# Altium schematic sheet CAMERA_INTERFACE.SchDoc
size B; SheetNumber: 6; SheetTotal: 10
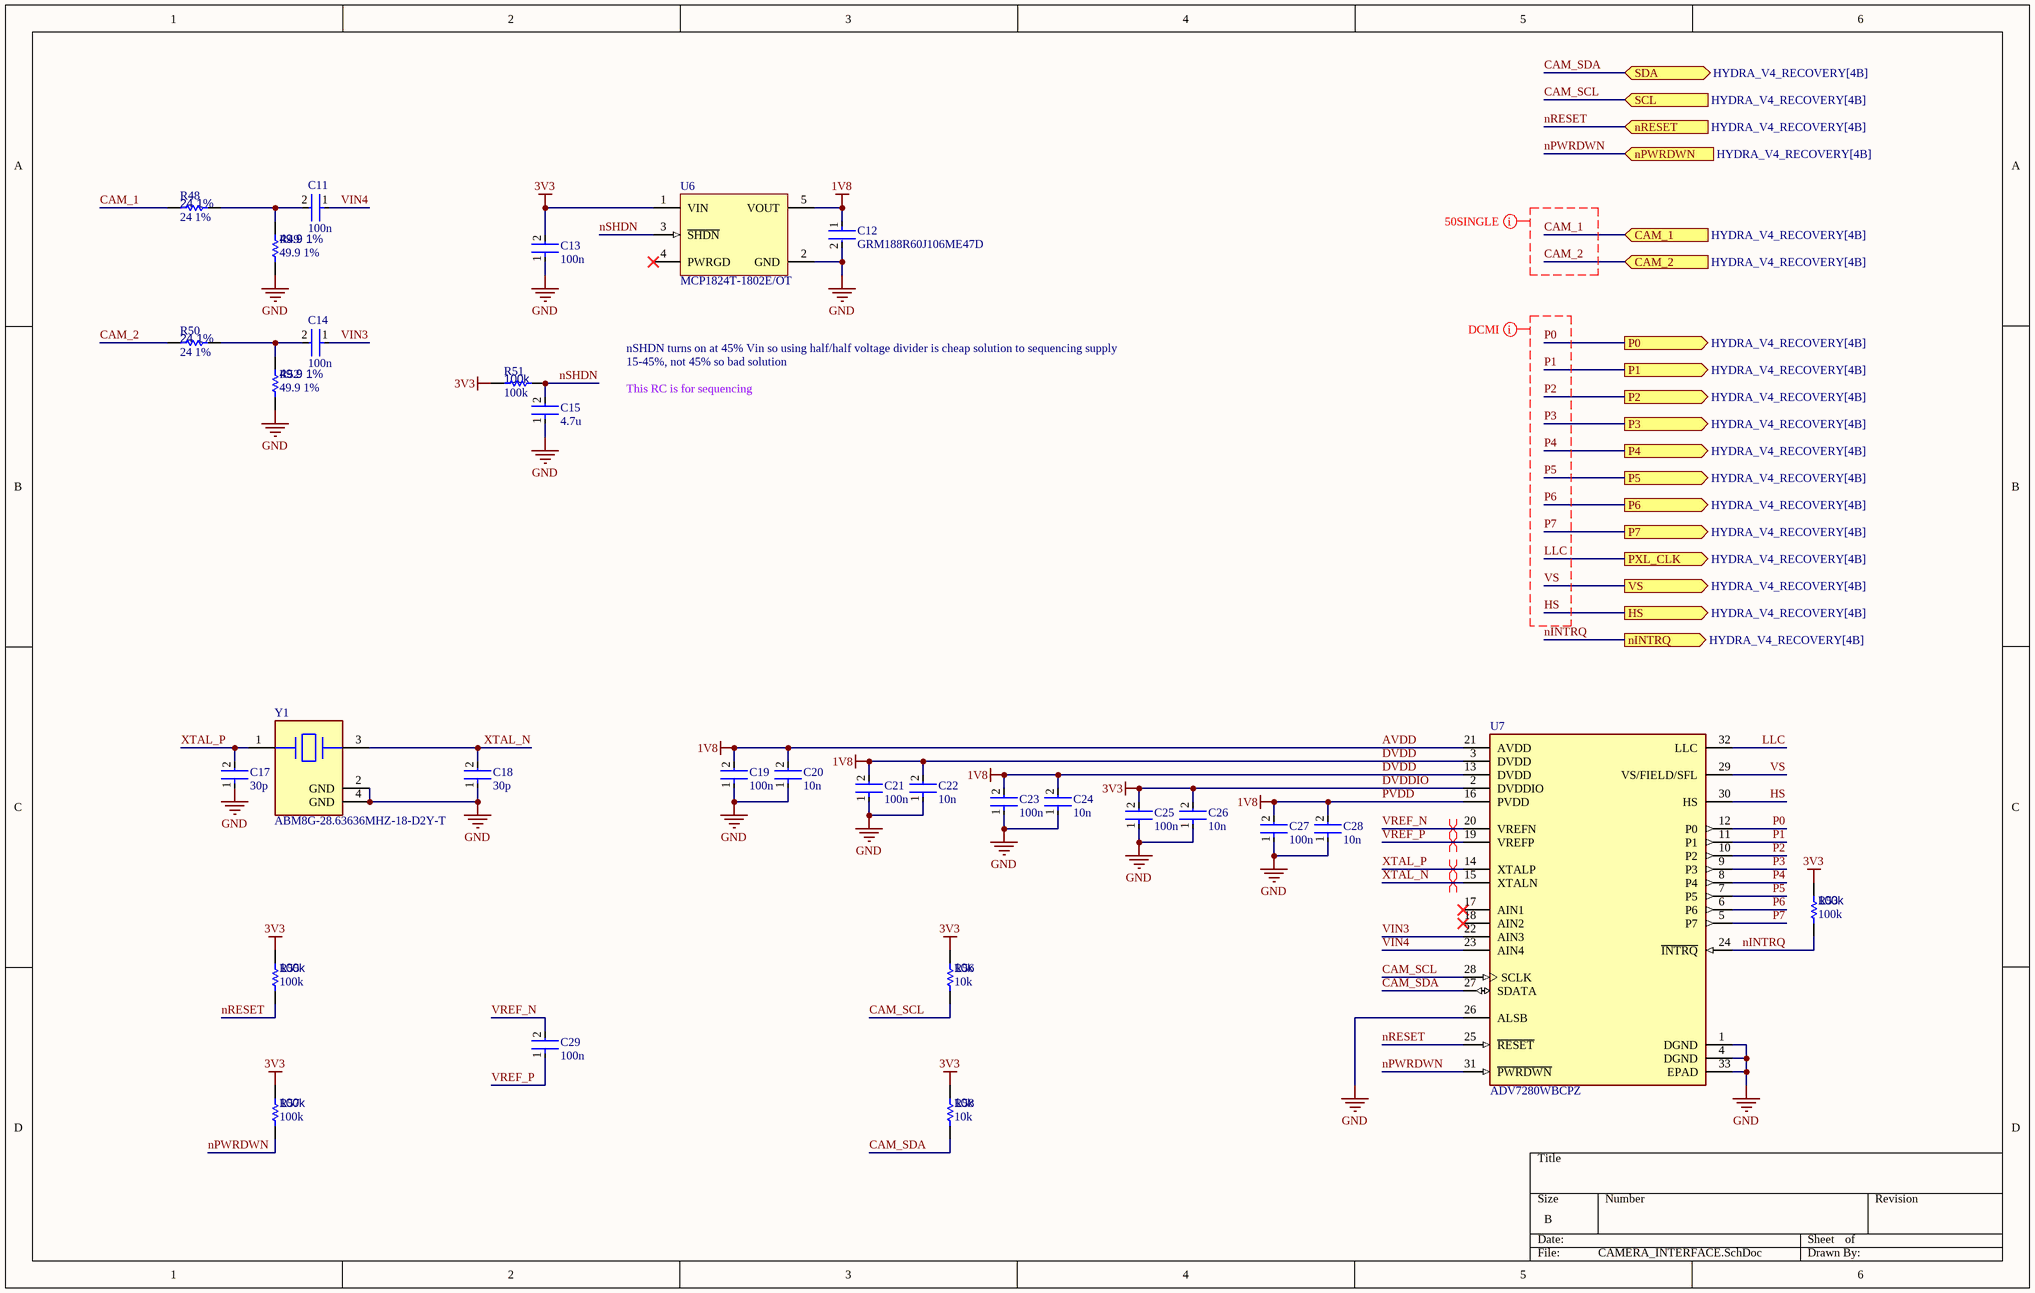
[diagram p0: CAMERA_INTERFACE.SchDoc]

## Parts
C11  100n  [FP-0402-L_1_0_0_05-W_0_5-IPC_A]
C12  GRM188R60J106ME47D  [FP-GRM188-0_1-e0_2_0_55-IPC_A]
C13  100n  [FP-0402-L_1_0_0_05-W_0_5-IPC_A]
C14  100n  [FP-0402-L_1_0_0_05-W_0_5-IPC_A]
C15  4.7u  [FP-0402-L_1_0_0_05-W_0_5-IPC_A]
C17  30p  [FP-0402-L_1_0_0_05-W_0_5-IPC_A]
C18  30p  [FP-0402-L_1_0_0_05-W_0_5-IPC_A]
C19  100n  [FP-0402-L_1_0_0_05-W_0_5-IPC_A]
C20  10n  [FP-0402-L_1_0_0_05-W_0_5-IPC_A]
C21  100n  [FP-0402-L_1_0_0_05-W_0_5-IPC_A]
C22  10n  [FP-0402-L_1_0_0_05-W_0_5-IPC_A]
C23  100n  [FP-0402-L_1_0_0_05-W_0_5-IPC_A]
C24  10n  [FP-0402-L_1_0_0_05-W_0_5-IPC_A]
C25  100n  [FP-0402-L_1_0_0_05-W_0_5-IPC_A]
C26  10n  [FP-0402-L_1_0_0_05-W_0_5-IPC_A]
C27  100n  [FP-0402-L_1_0_0_05-W_0_5-IPC_A]
C28  10n  [FP-0402-L_1_0_0_05-W_0_5-IPC_A]
C29  100n  [FP-0402-L_1_0_0_05-W_0_5-IPC_A]
R48  24 1%  [R0603B]
R49  49.9 1%  [R0603B]
R50  24 1%  [R0603B]
R51  100k  [R0603B]
R52  49.9 1%  [R0603B]
R53  100k  [R0603B]
R55  100k  [R0603B]
R56  10k  [R0603B]
R57  100k  [R0603B]
R58  10k  [R0603B]
U6  MCP1824T-1802E/OT  [SOT-23-OT5_M]
U7  ADV7280WBCPZ  [FP-CP-32-12-MFG]
Y1  ABM8G-28.63636MHZ-18-D2Y-T  [FP-ABM8G-MFG]

## Ports
CAM_1 (in, see HYDRA_V4_RECOVERY[4B]), CAM_2 (in, see HYDRA_V4_RECOVERY[4B]), HS (out, see HYDRA_V4_RECOVERY[4B]), nINTRQ (out, see HYDRA_V4_RECOVERY[4B]), nPWRDWN (in, see HYDRA_V4_RECOVERY[4B]), nRESET (in, see HYDRA_V4_RECOVERY[4B]), P0 (out, see HYDRA_V4_RECOVERY[4B]), P1 (out, see HYDRA_V4_RECOVERY[4B]), P2 (out, see HYDRA_V4_RECOVERY[4B]), P3 (out, see HYDRA_V4_RECOVERY[4B]), P4 (out, see HYDRA_V4_RECOVERY[4B]), P5 (out, see HYDRA_V4_RECOVERY[4B]), P6 (out, see HYDRA_V4_RECOVERY[4B]), P7 (out, see HYDRA_V4_RECOVERY[4B]), PXL_CLK (out, see HYDRA_V4_RECOVERY[4B]), SCL (in, see HYDRA_V4_RECOVERY[4B]), SDA (bidir, see HYDRA_V4_RECOVERY[4B]), VS (out, see HYDRA_V4_RECOVERY[4B])

## Nets
AVDD: C12.1 C19.2 C20.2 C21.2 C22.2 C23.2 C24.2 C27.2 C28.2 U6.5(VOUT) U7.3(DVDD) U7.13(DVDD) U7.16(PVDD) U7.21(AVDD)  [also labelled 1V8, DVDD, PVDD]
DVDDIO: C13.2 C25.2 C26.2 R51.2 R53.1 R55.1 R56.1 R57.1 R58.1 U6.1(VIN) U7.2(DVDDIO)  [also labelled 3V3]
GND: C12.2 C13.1 C15.1 C17.1 C18.1 C19.1 C20.1 C21.1 C22.1 C23.1 C24.1 C25.1 C26.1 C27.1 C28.1 R49.1 R52.1 U6.2(GND) U7.1(DGND) U7.4(DGND) U7.26(ALSB) U7.33(EPAD) Y1.2(GND) Y1.4(GND)
CAM_1: R48.2 ; port CAM_1
CAM_2: R50.2 ; port CAM_2
CAM_SCL: R56.2 U7.28(SCLK) ; port SCL
CAM_SDA: R58.2 U7.27(SDATA) ; port SDA
HS: U7.30(HS) ; port HS
LLC: U7.32(LLC) ; port PXL_CLK
nINTRQ: R53.2 U7.24(~{INTRQ}) ; port nINTRQ
nPWRDWN: R57.2 U7.31(~{PWRDWN}) ; port nPWRDWN
nRESET: R55.2 U7.25(~{RESET}) ; port nRESET
nSHDN: C15.2 R51.1 U6.3(~{SHDN})
P0: U7.12(P0) ; port P0
P1: U7.11(P1) ; port P1
P2: U7.10(P2) ; port P2
P3: U7.9(P3) ; port P3
P4: U7.8(P4) ; port P4
P5: U7.7(P5) ; port P5
P6: U7.6(P6) ; port P6
P7: U7.5(P7) ; port P7
VIN3: C14.1 U7.22(AIN3)
VIN4: C11.1 U7.23(AIN4)
VREF_N: C29.2 U7.20(VREFN)
VREF_P: C29.1 U7.19(VREFP)
VS: U7.29(VS/FIELD/SFL) ; port VS
XTAL_N: C18.2 U7.15(XTALN) Y1.3
XTAL_P: C17.2 U7.14(XTALP) Y1.1
NetC11_2: C11.2 R48.1 R49.2
NetC14_2: C14.2 R50.1 R52.2

Not connected (* = marked no-connect by the designer): U6 4(PWRGD)*; U7 17(AIN1)* 18(AIN2)*

## Layout directives
differential pair: VREF_N, VREF_P, XTAL_N, XTAL_P
net class DCMI: HS, LLC, P0, P1, P2, P3, P4, P5, P6, P7, VS
net class 50SINGLE: CAM_1, CAM_2

## Notes on the sheet
- nSHDN turns on at 45% Vin so using half/half voltage divider is cheap solution to sequencing supply
- 15-45%, not 45% so bad solution
- This RC is for sequencing

## Library data of the parts
C11 C13-C15 C17-C29 = CMP-001-00058-1: LARGE PADS, 0402 CAP, CHANGE COMMENT TO MATCH REAL P/N; Capacitor Type: Ceramic; Min Operating Temperature: -55°C; Mounting Technology: Surface Mount; Pins: 2; Case/Package: 0402; RoHS Compliant: Yes; Max Operating Temperature: 85°C
  C11 C13 C14 C19 C21 C23 C25 C27 C29: Value: 100n
  C15: Value: 4.7u
  C17 C18: Value: 30p
  C20 C22 C24 C26 C28: Value: 10n
C12 = CMP-2006-02792-2: Chip Multilayer Ceramic Capacitors for General Purpose, 0603, 10uF, X5R, 15%, 20%, 6.3V; Packaging: Tape and Reel; Voltage Rating (DC): 6.3V; Width: 0.031inch; Termination: SMD/SMT; Dielectric: X5R; Package Quantity: 4000; Voltage Rating: 6.3V; Capacitance: 10uF; Case/Package: 0603; Min Operating Temperature: -55°C; Voltage: 6.3V; Length: 1.6mm; Thickness: 0.035inch; Lead Free: Lead Free; Depth: 0.8mm; Case Code (Imperial): 0603; Max Operating Temperature: 85°C; Material: Ceramic; Height: 0.8mm; Tolerance: 20%; Mount: Surface Mount; REACH SVHC: No SVHC; Radiation Hardening: No; Case Code (Metric): 1608; Value: GRM188R60J106ME47D
R48-R53 R55-R58 = CMP-009-00002-14: Resistor
  R48 R50: Value: 24 1%
  R49 R52: Value: 49.9 1%
  R51 R53 R55 R57: Value: 100k
  R56 R58: Value: 10k
U6 = CMP-0136-00652-1: 300 mA, Low Voltage, Low Quiescent Current LDO Regulator, 5-Pin SOT-23, Extended Temperature, Tape and Reel; DatasheetVersion: revA, Aug-2007; PackageDescription: 5-Lead Plastic Small Outline Transistor (OT) [SOT-23]; Code_IPC: SOT23-5; PackageReference: SOT-23-OT5; PackageVersion: revBB, Aug-2009
U7 = CMP-015-00015-1: Color Signal Decoder, CMOS; Max Operating Temperature: 105°C; RoHS Compliant: Yes; Min Operating Temperature: -40°C; Pins: 32
Y1 = CMP-27762-014063-1: Crystal 28.63636MHz ±20ppm (Tol) ±30ppm (Stability) 18pF FUND 50Ω 4-Pin SMD T/R; ESR (Equivalent Series Resistance): 50R; Operating Frequency: 28.6 MHz; Length: 3.2mm; Lead Free: Lead Free; Width: 2.5mm; Termination: SMD/SMT; Series: ABM8G; Max Operating Temperature: 85°C; REACH SVHC: Yes; Mount: Surface Mount; Case/Package: SMD/SMT; Frequency Tolerance: 20ppm; Number of Pins: 4; Load Capacitance: 18pF; Tolerance: 20ppm; Series Resistance: 50R; Height: 1mm; Frequency: 28.63636MHz; Min Operating Temperature: -40°C; Frequency Stability: 30ppm; Package Quantity: 1000; Packaging: Tape and Reel; Radiation Hardening: No